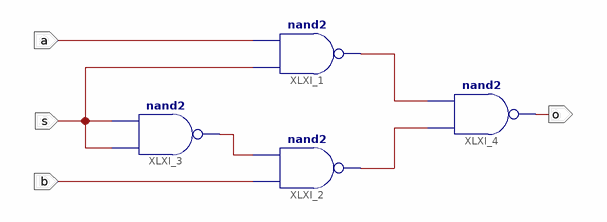
[diagram p0: schematic sheet 1]
// Xilinx ISE schematic Mux1bit.sch (spartan3e) as structural Verilog: 4 symbols, 4 ports
module Mux1bit (
  input  s,
  input  a,
  input  b,
  output o
);

  wire XLXN_1, XLXN_3, XLXN_4;

  nand XLXI_1 (XLXN_3, s, a);
  nand XLXI_2 (XLXN_1, b, XLXN_4);
  nand XLXI_3 (XLXN_4, s, s);
  nand XLXI_4 (o, XLXN_1, XLXN_3);
endmodule
